# Altium project US29080671(A).PrjPCB (part 6 of 10)

## Sheet Z7_ETHERNET.SchDoc
size A2
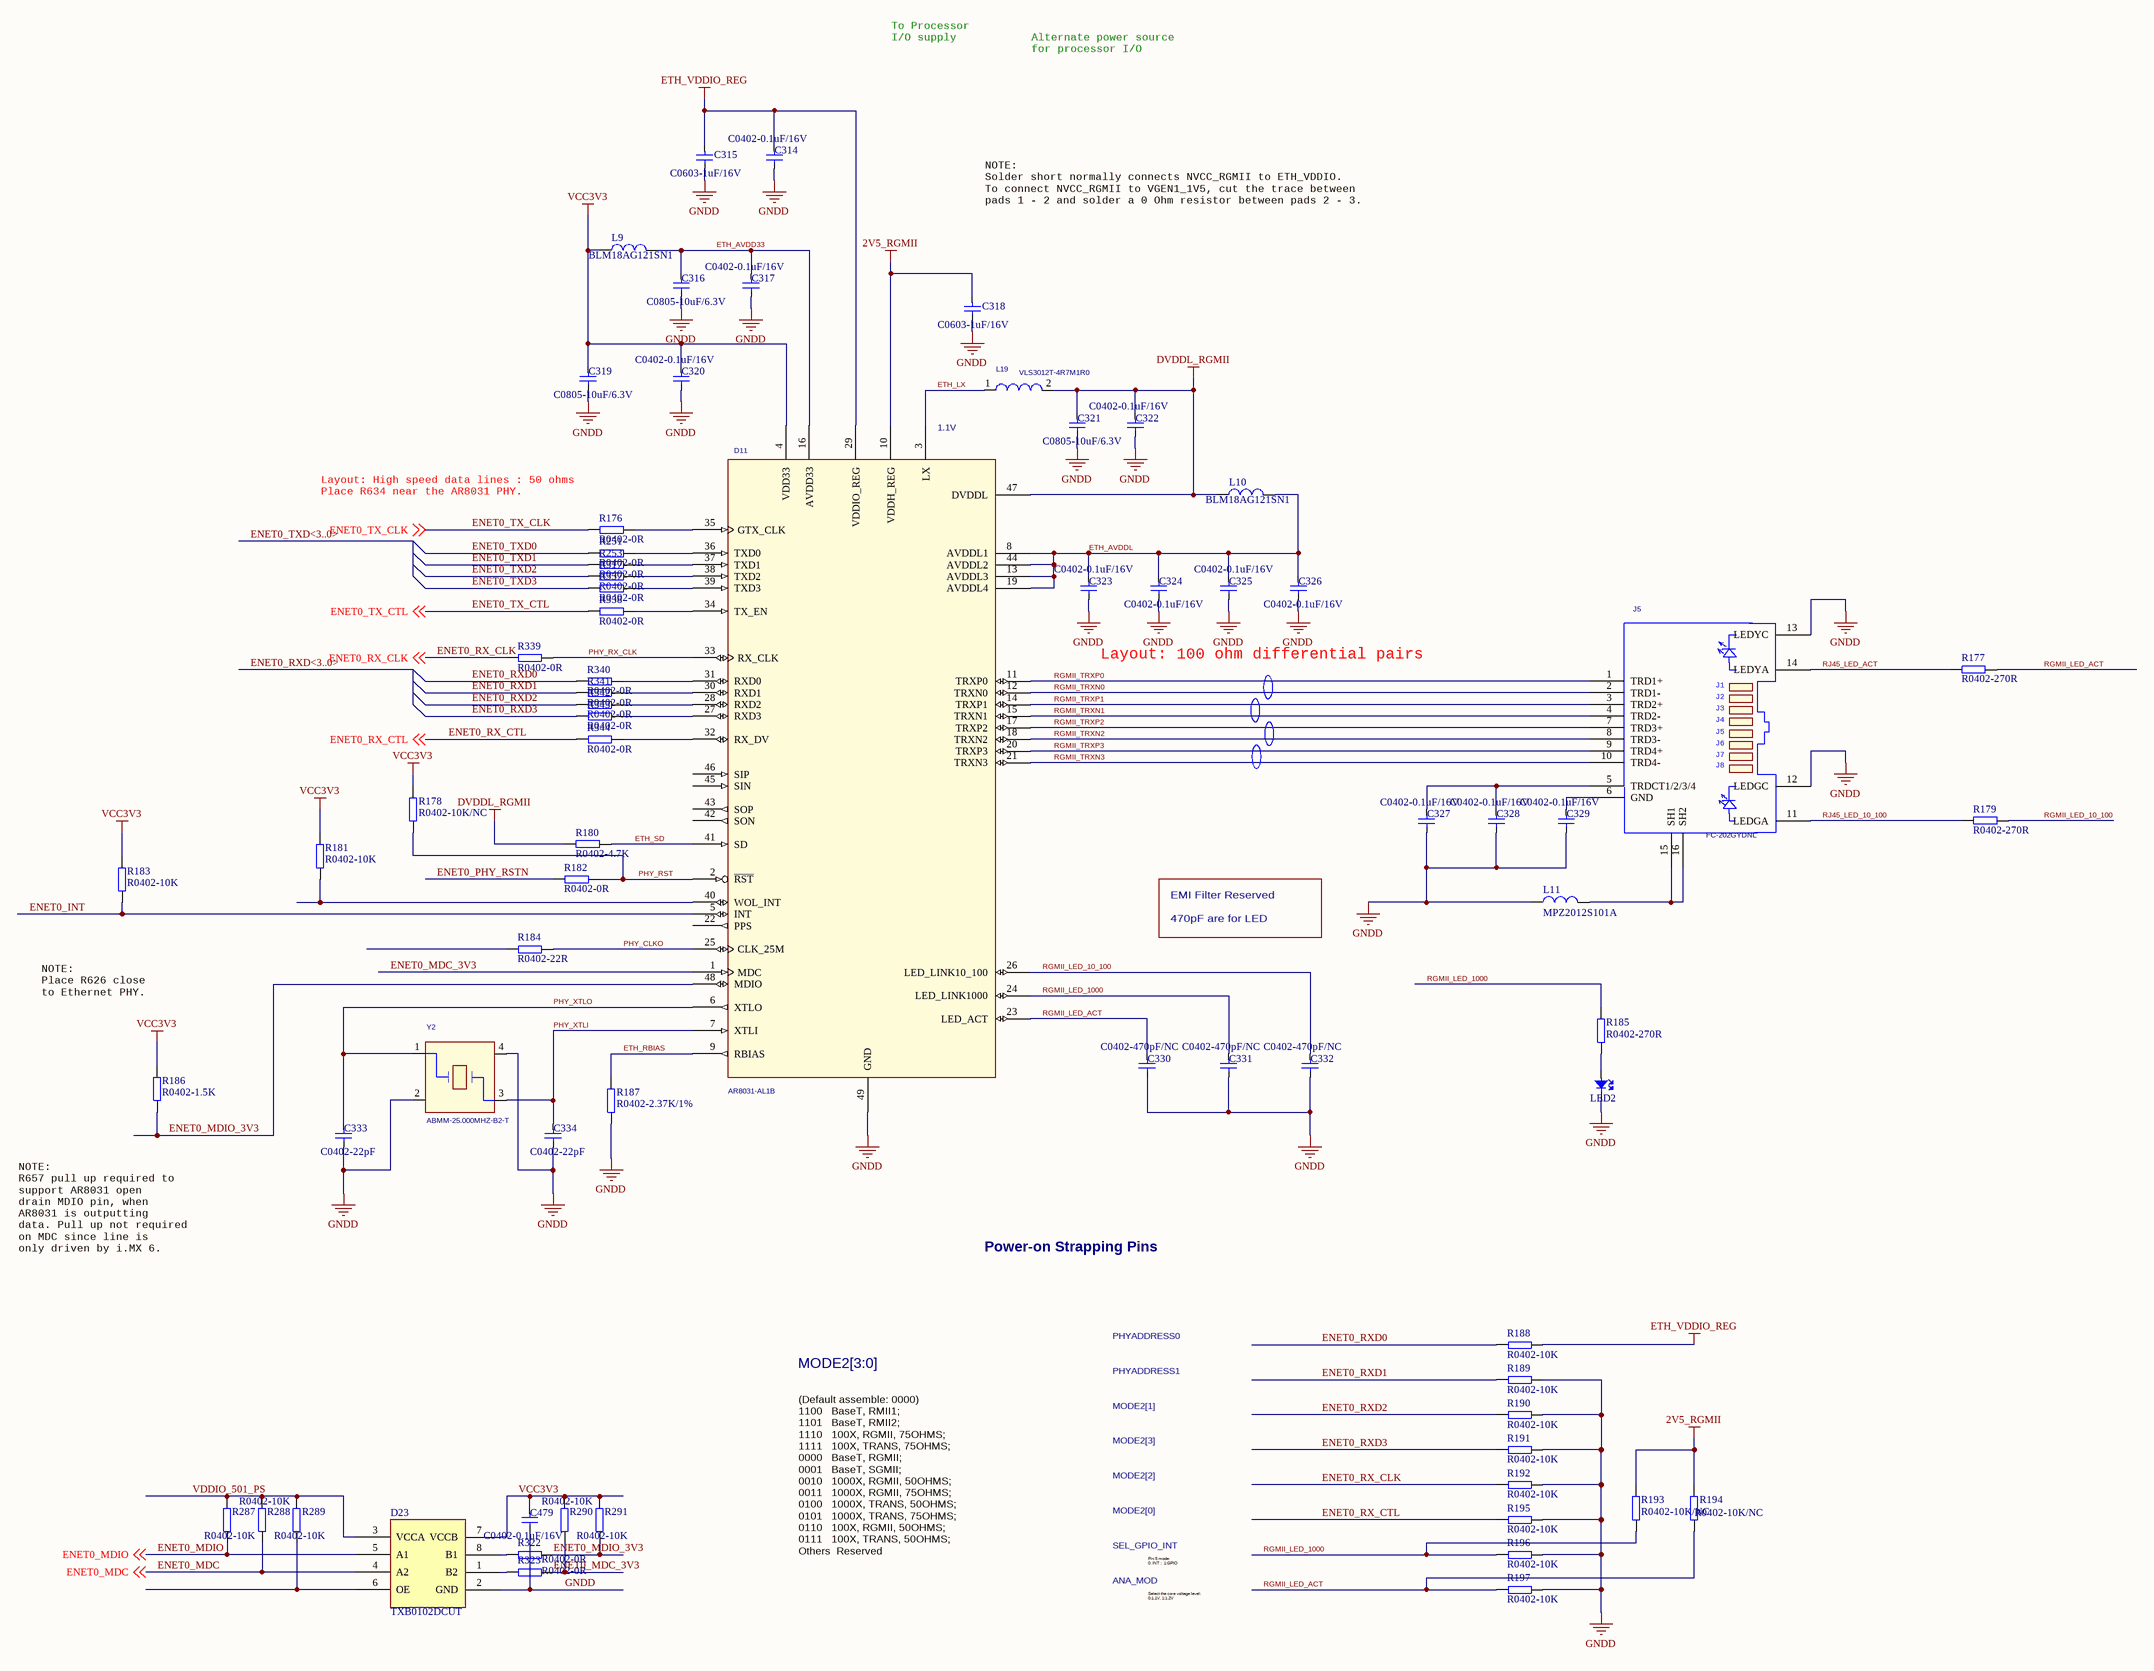
[diagram p30: Z7_ETHERNET.SchDoc]

### Parts
C314  C0402-0.1uF/16V  [C0402]
C315  C0603-1uF/16V  [C0603]
C316  C0805-10uF/6.3V  [C0805]
C317  C0402-0.1uF/16V  [C0402]
C318  C0603-1uF/16V  [C0603]
C319  C0805-10uF/6.3V  [C0805]
C320  C0402-0.1uF/16V  [C0402]
C321  C0805-10uF/6.3V  [C0805]
C322  C0402-0.1uF/16V  [C0402]
C323  C0402-0.1uF/16V  [C0402]
C324  C0402-0.1uF/16V  [C0402]
C325  C0402-0.1uF/16V  [C0402]
C326  C0402-0.1uF/16V  [C0402]
C327  C0402-0.1uF/16V  [C0402]
C328  C0402-0.1uF/16V  [C0402]
C329  C0402-0.1uF/16V  [C0402]
C330  C0402-470pF/NC  [C0402]
C331  C0402-470pF/NC  [C0402]
C332  C0402-470pF/NC  [C0402]
C333  C0402-22pF  [C0402]
C334  C0402-22pF  [C0402]
C479  C0402-0.1uF/16V  [C0402]
D11  AR8031-AL1B  [QFN-48N]
D23  TXB0102DCUT  [MSOP-8]
J5  FC-202GYDNL  [RJ45-1840710]
L9  BLM18AG121SN1  [R0603]
L10  BLM18AG121SN1  [R0603]
L11  MPZ2012S101A  [R0805]
L19  VLS3012T-4R7M1R0  [GTSD32P]
LED2  LED0603-GREEN  [LED-R0603]  (value not drawn)
R176  R0402-0R  [R0402]
R177  R0402-270R  [R0402]
R178  R0402-10K/NC  [R0402]
R179  R0402-270R  [R0402]
R180  R0402-4.7K  [R0402]
R181  R0402-10K  [R0402]
R182  R0402-0R  [R0402]
R183  R0402-10K  [R0402]
R184  R0402-22R  [R0402]
R185  R0402-270R  [R0402]
R186  R0402-1.5K  [R0402]
R187  R0402-2.37K/1%  [R0402]
R188  R0402-10K  [R0402]
R189  R0402-10K  [R0402]
R190  R0402-10K  [R0402]
R191  R0402-10K  [R0402]
R192  R0402-10K  [R0402]
R193  R0402-10K/NC  [R0402]
R194  R0402-10K/NC  [R0402]
R195  R0402-10K  [R0402]
R196  R0402-10K  [R0402]
R197  R0402-10K  [R0402]
R251  R0402-0R  [R0402]
R253  R0402-0R  [R0402]
R287  R0402-10K  [R0402]
R288  R0402-10K  [R0402]
R289  R0402-10K  [R0402]
R290  R0402-10K  [R0402]
R291  R0402-10K  [R0402]
R317  R0402-0R  [R0402]
R322  R0402-0R  [R0402]
R323  R0402-0R  [R0402]
R337  R0402-0R  [R0402]
R338  R0402-0R  [R0402]
R339  R0402-0R  [R0402]
R340  R0402-0R  [R0402]
R341  R0402-0R  [R0402]
R342  R0402-0R  [R0402]
R343  R0402-0R  [R0402]
R344  R0402-0R  [R0402]
Y2  ABMM-25.000MHZ-B2-T  [OSC3225-4P]

### Nets
2V5_RGMII: C318.1 D11.10(VDDH_REG) R193.2 R194.2
DVDDL_RGMII: C321.1 C322.1 D11.47(DVDDL) L10.1 L19.2 R180.2
ETH_VDDIO_REG: C314.1 C315.1 D11.29(VDDIO_REG) R188.2
GNDD: C314.2 C315.2 C316.2 C317.2 C318.2 C319.2 C320.2 C321.2 C322.2 C323.2 C324.2 C325.2 C326.2 C327.2 C328.2 C329.2 C330.2 C331.2 C332.2 C333.2 C334.2 C479.2 D11.49(GND) D23.2(GND) J5.12(LEDGC) J5.13(LEDYC) L11.1 LED2.2(K) R187.1 R189.2 R190.2 R191.2 R192.2 R195.2 R196.2 R197.2 Y2.2 Y2.4
VCC3V3: C319.1 C320.1 C479.1 D11.4(VDD33) D23.7(VCCB) L9.1 R178.2 R181.2 R183.2 R186.2 R290.2 R291.2
VDDIO_501_PS: D23.3(VCCA) R287.2 R288.2 R289.2  [project net VCC1V8]
ENET0_INT: D11.5(INT) R183.1
ENET0_MDC: D23.4(A2) R288.1 ; off-sheet ENET0_MDC
ENET0_MDC_3V3: D11.1(MDC) R290.1 R323.2
ENET0_MDIO: D23.5(A1) R287.1 ; off-sheet ENET0_MDIO
ENET0_MDIO_3V3: D11.48(MDIO) R186.1 R291.1 R322.2
ENET0_PHY_RSTN: R182.1
ENET0_RX_CLK: R192.1 R339.1 ; off-sheet ENET0_RX_CLK
ENET0_RX_CTL: R195.1 R344.1 ; off-sheet ENET0_RX_CTL
ENET0_RXD0: R188.1 R340.1
ENET0_RXD1: R189.1 R341.1
ENET0_RXD2: R190.1 R342.1
ENET0_RXD3: R191.1 R343.1
ENET0_TX_CLK: R176.1 ; off-sheet ENET0_TX_CLK
ENET0_TX_CTL: R338.1 ; off-sheet ENET0_TX_CTL
ENET0_TXD0: R251.1
ENET0_TXD1: R253.1
ENET0_TXD2: R317.1
ENET0_TXD3: R337.1
ETH_AVDD33: C316.1 C317.1 D11.16(AVDD33) L9.2
ETH_AVDDL: C323.1 C324.1 C325.1 C326.1 D11.8(AVDDL1) D11.13(AVDDL3) D11.19(AVDDL4) D11.44(AVDDL2) L10.2
ETH_LX: D11.3(LX) L19.1
ETH_RBIAS: D11.9(RBIAS) R187.2
ETH_SD: D11.41(SD) R180.1
PHY_CLKO: D11.25(CLK_25M) R184.2
PHY_RST: D11.2(~{RST}) R178.1 R182.2
PHY_RX_CLK: D11.33(RX_CLK) R339.2
PHY_XTLI: C334.1 D11.7(XTLI) Y2.3
PHY_XTLO: C333.1 D11.6(XTLO) Y2.1
RGMII_LED_10_100: C332.1 D11.26(LED_LINK10_100) R179.1
RGMII_LED_1000: C331.1 D11.24(LED_LINK1000) R185.2 R193.1 R196.1
RGMII_LED_ACT: C330.1 D11.23(LED_ACT) R177.1 R194.1 R197.1
RGMII_TRXN0: D11.12(TRXN0) J5.2(TRD1-)
RGMII_TRXN1: D11.15(TRXN1) J5.4(TRD2-)
RGMII_TRXN2: D11.18(TRXN2) J5.8(TRD3-)
RGMII_TRXN3: D11.21(TRXN3) J5.10(TRD4-)
RGMII_TRXP0: D11.11(TRXP0) J5.1(TRD1+)
RGMII_TRXP1: D11.14(TRXP1) J5.3(TRD2+)
RGMII_TRXP2: D11.17(TRXP2) J5.7(TRD3+)
RGMII_TRXP3: D11.20(TRXP3) J5.9(TRD4+)
RJ45_LED_10_100: J5.11(LEDGA) R179.2
RJ45_LED_ACT: J5.14(LEDYA) R177.2
NetC327_1: C327.1 C328.1 J5.5(TRDCT1/2/3/4)
NetC329_1: C329.1 J5.6(GND)
NetD11_27: D11.27(RXD3) R343.2
NetD11_28: D11.28(RXD2) R342.2
NetD11_30: D11.30(RXD1) R341.2
NetD11_31: D11.31(RXD0) R340.2
NetD11_32: D11.32(RX_DV) R344.2
NetD11_34: D11.34(TX_EN) R338.2
NetD11_35: D11.35(GTX_CLK) R176.2
NetD11_36: D11.36(TXD0) R251.2
NetD11_37: D11.37(TXD1) R253.2
NetD11_38: D11.38(TXD2) R317.2
NetD11_39: D11.39(TXD3) R337.2
NetD11_40: D11.40(WOL_INT) R181.1
NetD23_1: D23.1(B2) R323.1
NetD23_6: D23.6(OE) R289.1
NetD23_8: D23.8(B1) R322.1
NetJ5_15: J5.15(SH1) J5.16(SH2) L11.2
NetLED2_1: LED2.1(A) R185.1

Not connected (* = marked no-connect by the designer): D11 22(PPS) 42(SON) 43(SOP) 45(SIN) 46(SIP); R184 1

### Buses and harness runs
bus ENET0_RXD<3..0>
bus ENET0_TXD<3..0>

### Notes on the sheet
- To Processor
  I/O supply
- Alternate power source
  for processor I/O
- NOTE:
  Solder short normally connects NVCC_RGMII to ETH_VDDIO.
  To connect NVCC_RGMII to VGEN1_1V5, cut the trace between
  pads 1 - 2 and solder a 0 Ohm resistor between pads 2 - 3.
- (near D11) 1.1V
- Layout: High speed data lines : 50 ohms
  Place R634 near the AR8031 PHY.
- Layout: 100 ohm differential pairs
- 470pF are for LED
- EMI Filter Reserved
- NOTE:
  Place R626 close
  to Ethernet PHY.
- NOTE:
  R657 pull up required to
  support AR8031 open
  drain MDIO pin, when
  AR8031 is outputting
  data. Pull up not required
  on MDC since line is
  only driven by i.MX 6.
- Power-on Strapping Pins
- PHYADDRESS0
- MODE2[3:0]
- PHYADDRESS1
- MODE2[3]
- MODE2[1]
- MODE2[2]
- MODE2[0]
- SEL_GPIO_INT
- Pin 5 mode:
  0: INT ;  1:GPIO
- (Default assemble: 0000)
  1100   BaseT, RMII1;
  1101   BaseT, RMII2;
  1110   100X, RGMII, 75OHMS;
  1111   100X, TRANS, 75OHMS;
  0000   BaseT, RGMII;
  0001   BaseT, SGMII;
  0010   1000X, RGMII, 50OHMS;
  0011   1000X, RGMII, 75OHMS;
  0100   1000X, TRANS, 50OHMS;
  0101   1000X, TRANS, 75OHMS;
  0110   100X, RGMII, 50OHMS;
  0111   100X, TRANS, 50OHMS;
  Others  Reserved
- ANA_MOD
- Select the core voltage level:
  0:1.1V, 1:1.2V
- (in symbol V890-1AX1-A1_2) J1; J2; J3; J4; J6; J7; J8

### Library data of the parts
C314 C317 C320 C322-C334 C479 = C0402-0.1uF/16V: as C351-C357 on sheet Z7_POWER1; Part_type: CAP; temperature: -55℃\+125℃; Schematic_Part: CAP; PCB_Footprint: C0402; datasheet: #DataSheet\C_Samsung_General Capacitors.pdf#
  C314 C317 C320 C322-C329 C479: Part_number: C0402-0.1uF/16V; Value: C0402-0.1uF/16V
  C330-C332: Part_number: C0402-470pF/NC; Value: C0402-470pF/NC
  C333 C334: Part_number: C0402-22pF; Value: C0402-22pF
C315 C318 = C0603-100nF/16V: X7R; Part_number: C0603-1uF/16V; Part_type: CAP; Value: C0603-1uF/16V; temperature: -55℃\+125℃; Schematic_Part: CAP; PCB_Footprint: C0603
C316 C319 C321 = C1210-22uF/16V: Part_number: C0805-10uF/6.3V; Part_type: CAP; Value: C0805-10uF/6.3V; Schematic_Part: CAP; PCB_Footprint: C0805
D11 = AR8031_QFN48: IC XCVR ETHERNET PHY 10/100/1000G-BIT 3.3V QFN48; AGILE_PN: 312-80115; MFG_NAME01: Atheros Communications, Inc; CAD_APPROVED: Yes; CLASS: IC; MFG_PN01: AR8031-AL1B; ROHS: Yes; HEIGHT: 0.8MM
D23 = TXB0102: Part_number: TXB0102DCUT
J5 = V890-1AX1-A1_2: CON 10 RJ-45 SHLD TH G/Y LEDS 50MIL SP 662H AU 125L; CLASS: IO; CAD_APPROVED: Yes; MFG_NAME01: BEL FUSE; AGILE_PN: 210-79982; HEIGHT: 16.814MM; ROHS: Yes; MFG_PN01: FC-202GYDNL
L9 L10 = FB0805-330R@100MHz: Manufacturer: 村田; Part_number: BLM18AG121SN1; Part_type: BEAD; temperature: -55℃\+125℃; Value1: 330R@100MHz; Schematic_Part: BEAD; PCB_Footprint: R0603; Manufacturer_p/n: BLM18AG121SN1
L11 = FB0805-330R@100MHz: Manufacturer: TDK; Part_number: MPZ2012S101A; Part_type: BEAD; temperature: -55℃\+125℃; Value1: 330R@100MHz; Schematic_Part: BEAD; PCB_Footprint: R0805; Manufacturer_p/n: MPZ2012S101A
L19 = INDUCTOR_0: IND PWR 4.7UH@1MHZ 1A 20% SMD; PART_TYPE: INDUCTOR\POWER; CLASS: DISCRETE; ROOM: RGMII_PHY; AGILE_PN: 180-77706; MFG_NAME01: TDK; CAD_APPROVED: Yes; PRIORITY_PN: 024-00152; SIGNAL_MODEL: DEFAULT_INDUCTOR_4700nH_2_1; Tolerance: 20%; MFG_PN01: VLS3012T-4R7M1R0; ROHS: Yes; HEIGHT: 1.2MM
LED2 = LED-R_3: as LED3 on sheet Z7_JTAG&DEBUG; Part_number: LED0603-GREEN
R176-R197 R251 R253 R287-R291 R317 R322 R323 R337-R344 = R0402-10K: Manufacturer: SAMSUNG; Part_type: RES; Schematic_Part: RES; PCB_Footprint: R0402
  R176 R182 R251 R253 R317 R322 R323 R337-R344: Part_number: R0402-0R; Value: R0402-0R
  R177 R179 R185: Part_number: R0402-270R; Value: R0402-270R
  R178 R193 R194: Part_number: R0402-10K/NC; Value: R0402-10K/NC
  R180: Part_number: R0402-4.7K; Value: R0402-4.7K
  R181 R183 R188-R192 R195-R197 R287-R291: Part_number: R0402-10K; Value: R0402-10K
  R184: Part_number: R0402-22R; Value: R0402-22R
  R186: Part_number: R0402-1.5K; Value: R0402-1.5K
  R187: Part_number: R0402-2.37K/1%; Value: R0402-2.37K/1%
Y2 = XTAL_13Y: XTAL 25MHZ -- -- SMT; CLASS: IC; CAD_APPROVED: Yes; MFG_NAME01: ABRACON CORP; AGILE_PN: 230-77853; HEIGHT: 1.3MM; ROHS: Yes; MFG_PN01: ABMM-25.000MHZ-B2-T

## Sheet Z7_STORAGE.SchDoc
size A3
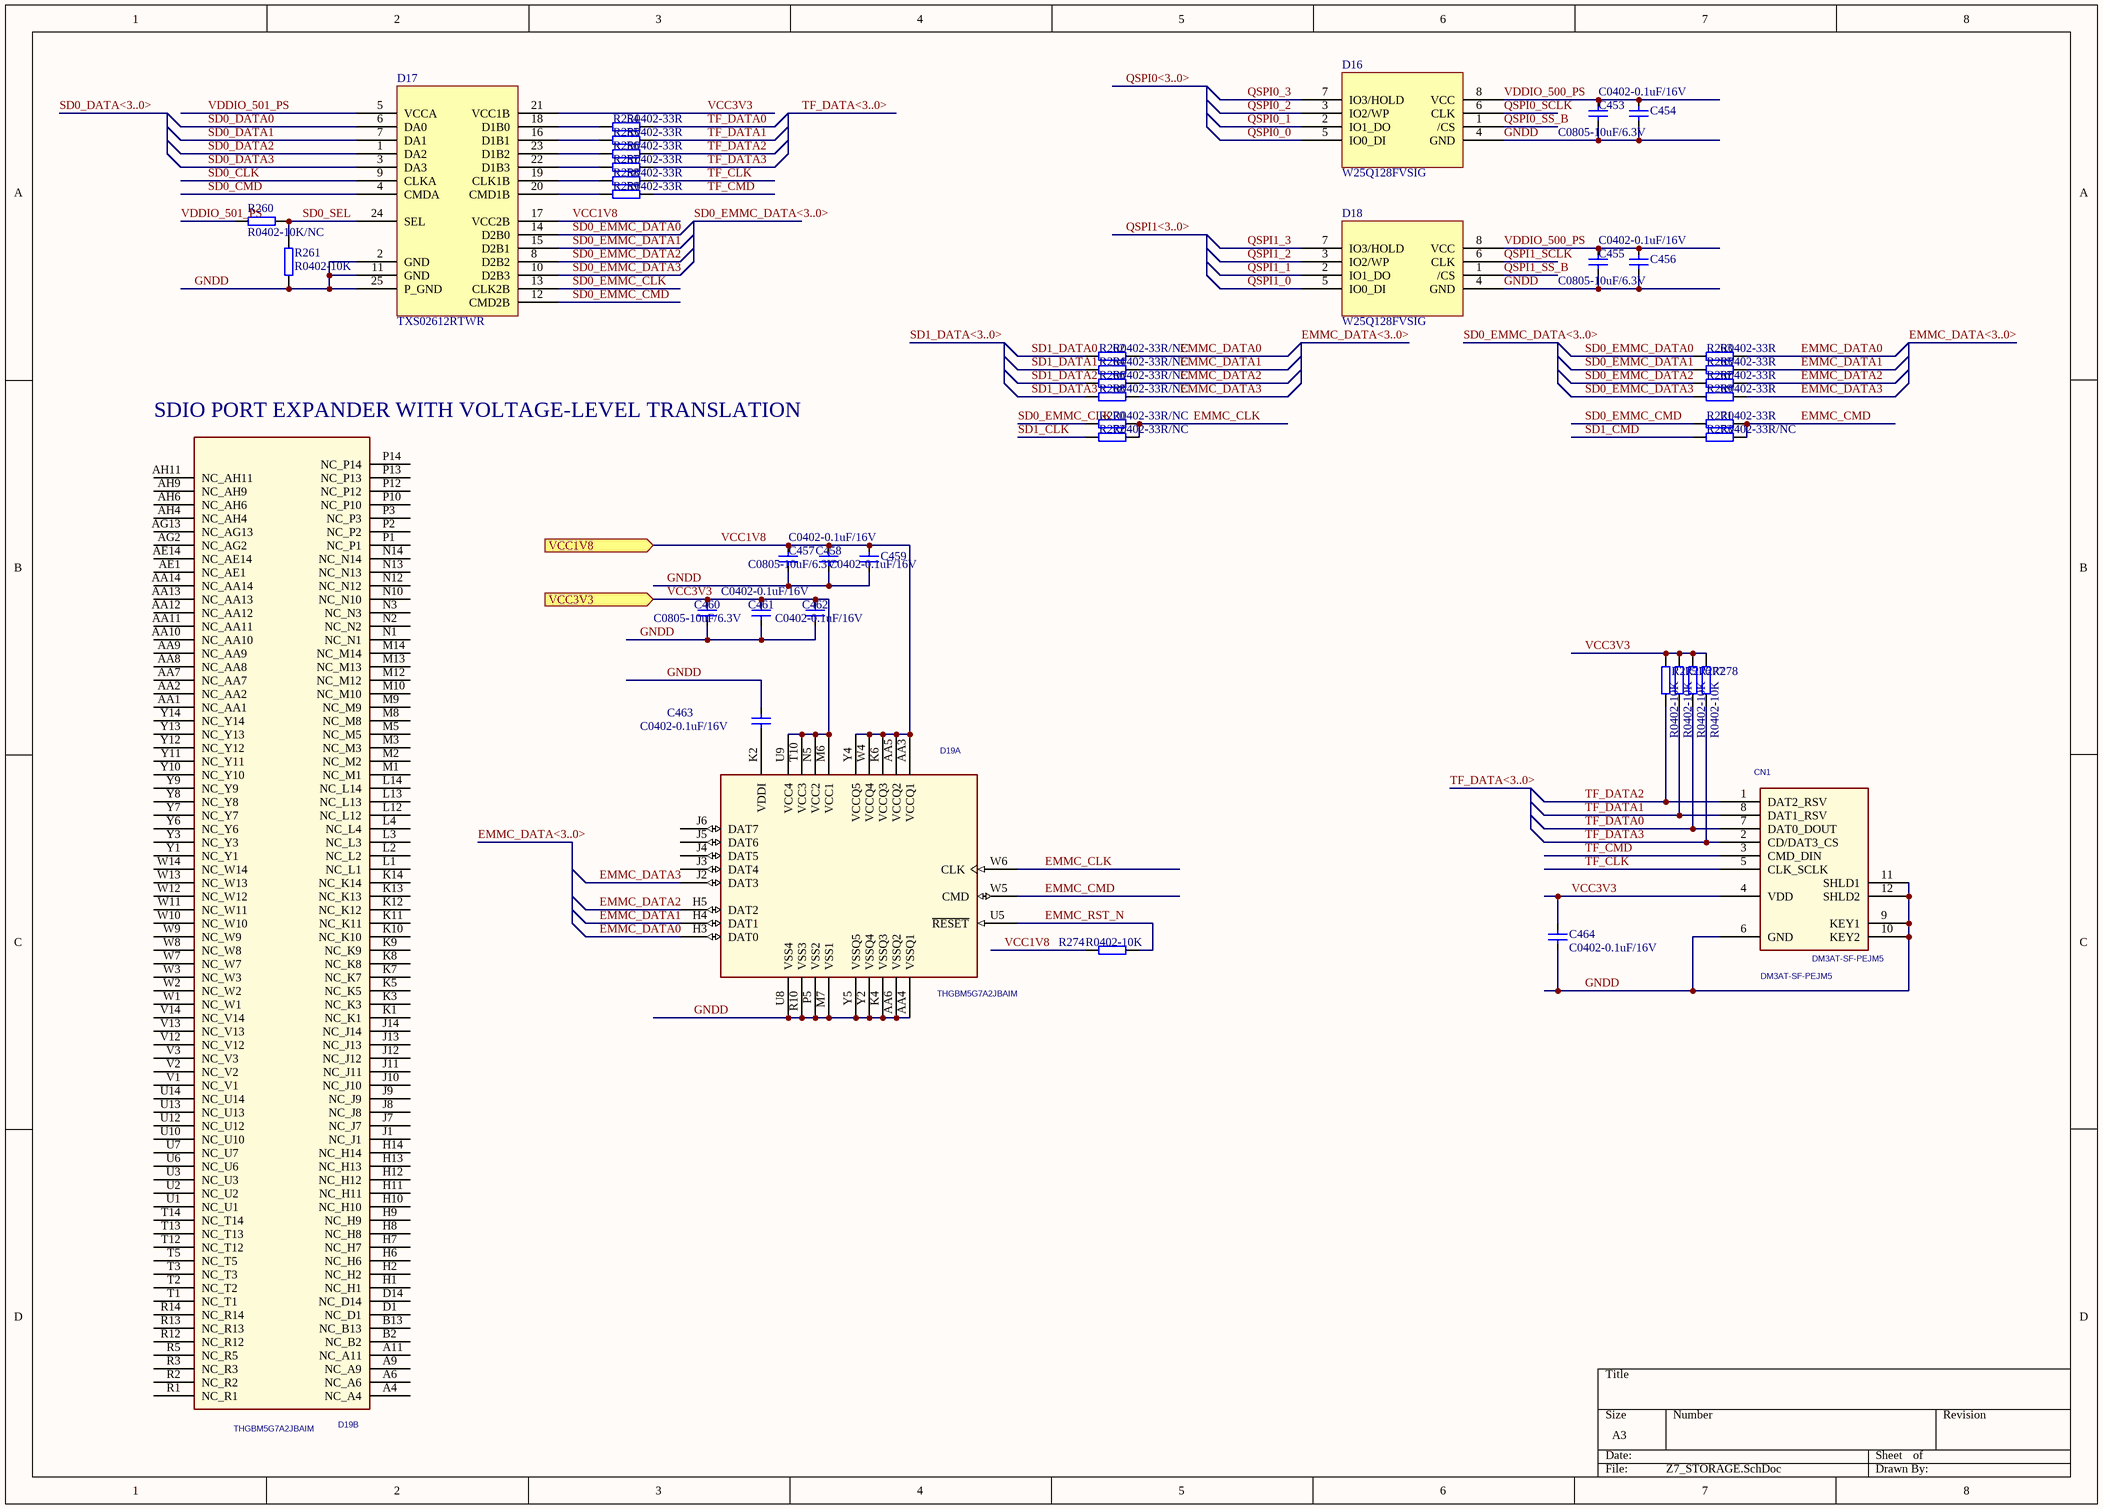
[diagram p31: Z7_STORAGE.SchDoc]

### Parts
C453  C0805-10uF/6.3V  [C0805]
C454  C0402-0.1uF/16V  [C0402]
C455  C0805-10uF/6.3V  [C0805]
C456  C0402-0.1uF/16V  [C0402]
C457  C0805-10uF/6.3V  [C0805]
C458  C0402-0.1uF/16V  [C0402]
C459  C0402-0.1uF/16V  [C0402]
C460  C0805-10uF/6.3V  [C0805]
C461  C0402-0.1uF/16V  [C0402]
C462  C0402-0.1uF/16V  [C0402]
C463  C0402-0.1uF/16V  [C0402]
C464  C0402-0.1uF/16V  [C0402]
CN1  DM3AT-SF-PEJM5  [HRS-SD]
D16  W25Q128FVSIG  [SOIC-W8]
D17  TXS02612RTWR  [QFN-24]
D18  W25Q128FVSIG  [SOIC-W8]
D19  THGBM5G7A2JBAIM  [BGA-169]  (parts A,B of 2)
R254  R0402-33R  [R0402]
R255  R0402-33R  [R0402]
R256  R0402-33R  [R0402]
R257  R0402-33R  [R0402]
R258  R0402-33R  [R0402]
R259  R0402-33R  [R0402]
R260  R0402-10K/NC  [R0402]
R261  R0402-10K  [R0402]
R262  R0402-33R/NC  [R0402]
R263  R0402-33R  [R0402]
R264  R0402-33R/NC  [R0402]
R265  R0402-33R  [R0402]
R266  R0402-33R/NC  [R0402]
R267  R0402-33R  [R0402]
R268  R0402-33R/NC  [R0402]
R269  R0402-33R  [R0402]
R270  R0402-33R/NC  [R0402]
R271  R0402-33R  [R0402]
R272  R0402-33R/NC  [R0402]
R273  R0402-33R/NC  [R0402]
R274  R0402-10K  [R0402]
R275  R0402-10K  [R0402]
R276  R0402-10K  [R0402]
R277  R0402-10K  [R0402]
R278  R0402-10K  [R0402]

### Ports
VCC1V8 (in), VCC3V3 (in)

### Nets
GNDD: C453.2 C454.1 C455.2 C456.1 C457.2 C458.1 C459.1 C460.2 C461.1 C462.1 C463.2 C464.1 CN1.6(GND) CN1.9(KEY1) CN1.10(KEY2) CN1.11(SHLD1) CN1.12(SHLD2) D16.4(GND) D17.2(GND) D17.11(GND) D17.25(P_GND) D18.4(GND) D19.AA4(VSSQ1) D19.AA6(VSSQ2) D19.K4(VSSQ3) D19.M7(VSS1) D19.P5(VSS2) D19.R10(VSS3) D19.U8(VSS4) D19.Y2(VSSQ4) D19.Y5(VSSQ5) R261.1
VCC1V8: C453.1 C454.2 C455.1 C456.2 C457.1 C458.2 C459.2 D16.8(VCC) D17.5(VCCA) D17.17(VCC2B) D18.8(VCC) D19.AA3(VCCQ1) D19.AA5(VCCQ2) D19.K6(VCCQ3) D19.W4(VCCQ4) D19.Y4(VCCQ5) R260.2 R274.1 ; port VCC1V8  [also labelled VDDIO_500_PS, VDDIO_501_PS]
VCC3V3: C460.1 C461.2 C462.2 C464.2 CN1.4(VDD) D17.21(VCC1B) D19.M6(VCC1) D19.N5(VCC2) D19.T10(VCC3) D19.U9(VCC4) R275.1 R276.1 R277.1 R278.1 ; port VCC3V3
EMMC_CLK: D19.W6(CLK) R270.2 R272.2
EMMC_CMD: D19.W5(CMD) R271.2 R273.2
EMMC_DATA0: D19.H3(DAT0) R262.2 R263.2
EMMC_DATA1: D19.H4(DAT1) R264.2 R265.2
EMMC_DATA2: D19.H5(DAT2) R266.2 R267.2
EMMC_DATA3: D19.J2(DAT3) R268.2 R269.2
EMMC_RST_N: D19.U5(~{RESET}) R274.2
QSPI0_0: D16.5(IO0_DI)
QSPI0_1: D16.2(IO1_DO)
QSPI0_2: D16.3(IO2/WP)
QSPI0_3: D16.7(IO3/HOLD)
QSPI0_SCLK: D16.6(CLK)
QSPI0_SS_B: D16.1(/CS)
QSPI1_0: D18.5(IO0_DI)
QSPI1_1: D18.2(IO1_DO)
QSPI1_2: D18.3(IO2/WP)
QSPI1_3: D18.7(IO3/HOLD)
QSPI1_SCLK: D18.6(CLK)
QSPI1_SS_B: D18.1(/CS)
SD0_CLK: D17.9(CLKA)
SD0_CMD: D17.4(CMDA)
SD0_DATA0: D17.6(DA0)
SD0_DATA1: D17.7(DA1)
SD0_DATA2: D17.1(DA2)
SD0_DATA3: D17.3(DA3)
SD0_EMMC_CLK: D17.13(CLK2B) R270.1
SD0_EMMC_CMD: D17.12(CMD2B) R271.1
SD0_EMMC_DATA0: D17.14(D2B0) R263.1
SD0_EMMC_DATA1: D17.15(D2B1) R265.1
SD0_EMMC_DATA2: D17.8(D2B2) R267.1
SD0_EMMC_DATA3: D17.10(D2B3) R269.1
SD0_SEL: D17.24(SEL) R260.1 R261.2
SD1_CLK: R272.1
SD1_CMD: R273.1
SD1_DATA0: R262.1
SD1_DATA1: R264.1
SD1_DATA2: R266.1
SD1_DATA3: R268.1
TF_CLK: CN1.5(CLK_SCLK) R258.2
TF_CMD: CN1.3(CMD_DIN) R259.2
TF_DATA0: CN1.7(DAT0_DOUT) R254.2 R277.2
TF_DATA1: CN1.8(DAT1_RSV) R255.2 R276.2
TF_DATA2: CN1.1(DAT2_RSV) R256.2 R275.2
TF_DATA3: CN1.2(CD/DAT3_CS) R257.2 R278.2
NetC463_1: C463.1 D19.K2(VDDI)
NetD17_16: D17.16(D1B1) R255.1
NetD17_18: D17.18(D1B0) R254.1
NetD17_19: D17.19(CLK1B) R258.1
NetD17_20: D17.20(CMD1B) R259.1
NetD17_22: D17.22(D1B3) R257.1
NetD17_23: D17.23(D1B2) R256.1

Not connected (* = marked no-connect by the designer): D19 A4(NC_A4) A6(NC_A6) A9(NC_A9) A11(NC_A11) AA1(NC_AA1) AA2(NC_AA2) AA7(NC_AA7) AA8(NC_AA8) AA9(NC_AA9) AA10(NC_AA10) AA11(NC_AA11) AA12(NC_AA12) AA13(NC_AA13) AA14(NC_AA14) AE1(NC_AE1) AE14(NC_AE14) AG2(NC_AG2) AG13(NC_AG13) AH4(NC_AH4) AH6(NC_AH6) AH9(NC_AH9) AH11(NC_AH11) B2(NC_B2) B13(NC_B13) D1(NC_D1) D14(NC_D14) H1(NC_H1) H2(NC_H2) H6(NC_H6) H7(NC_H7) H8(NC_H8) H9(NC_H9) H10(NC_H10) H11(NC_H11) H12(NC_H12) H13(NC_H13) H14(NC_H14) J1(NC_J1) J3(DAT4) J4(DAT5) J5(DAT6) J6(DAT7) J7(NC_J7) J8(NC_J8) J9(NC_J9) J10(NC_J10) J11(NC_J11) J12(NC_J12) J13(NC_J13) J14(NC_J14) K1(NC_K1) K3(NC_K3) K5(NC_K5) K7(NC_K7) K8(NC_K8) K9(NC_K9) K10(NC_K10) K11(NC_K11) K12(NC_K12) K13(NC_K13) K14(NC_K14) L1(NC_L1) L2(NC_L2) L3(NC_L3) L4(NC_L4) L12(NC_L12) L13(NC_L13) L14(NC_L14) M1(NC_M1) M2(NC_M2) M3(NC_M3) M5(NC_M5) M8(NC_M8) M9(NC_M9) M10(NC_M10) M12(NC_M12) M13(NC_M13) M14(NC_M14) N1(NC_N1) N2(NC_N2) N3(NC_N3) N10(NC_N10) N12(NC_N12) N13(NC_N13) N14(NC_N14) P1(NC_P1) P2(NC_P2) P3(NC_P3) P10(NC_P10) P12(NC_P12) P13(NC_P13) P14(NC_P14) R1(NC_R1) R2(NC_R2) R3(NC_R3) R5(NC_R5) R12(NC_R12) R13(NC_R13) R14(NC_R14) T1(NC_T1) T2(NC_T2) T3(NC_T3) T5(NC_T5) T12(NC_T12) T13(NC_T13) T14(NC_T14) U1(NC_U1) U2(NC_U2) U3(NC_U3) U6(NC_U6) U7(NC_U7) U10(NC_U10) U12(NC_U12) U13(NC_U13) U14(NC_U14) V1(NC_V1) V2(NC_V2) V3(NC_V3) V12(NC_V12) V13(NC_V13) V14(NC_V14) W1(NC_W1) W2(NC_W2) W3(NC_W3) W7(NC_W7) W8(NC_W8) W9(NC_W9) W10(NC_W10) W11(NC_W11) W12(NC_W12) W13(NC_W13) W14(NC_W14) Y1(NC_Y1) Y3(NC_Y3) Y6(NC_Y6) Y7(NC_Y7) Y8(NC_Y8) Y9(NC_Y9) Y10(NC_Y10) Y11(NC_Y11) Y12(NC_Y12) Y13(NC_Y13) Y14(NC_Y14)

### Buses and harness runs
bus EMMC_DATA<3..0>
bus QSPI0<3..0>
bus QSPI1<3..0>
bus SD0_DATA<3..0>
bus SD0_EMMC_DATA<3..0>
bus SD1_DATA<3..0>
bus TF_DATA<3..0>

### Notes on the sheet
- (near D19) SDIO PORT EXPANDER WITH VOLTAGE-LEVEL TRANSLATION

### Library data of the parts
C453 C455 C457 C460 = C1210-22uF/16V: Part_number: C0805-10uF/6.3V; Part_type: CAP; Value: C0805-10uF/6.3V; Schematic_Part: CAP; PCB_Footprint: C0805
C454 C456 C458 C459 C461-C464 = C0402-0.1uF/16V: as C351-C357 on sheet Z7_POWER1; Part_number: C0402-0.1uF/16V; Part_type: CAP; Value: C0402-0.1uF/16V; temperature: -55℃\+125℃; Schematic_Part: CAP; PCB_Footprint: C0402; datasheet: #DataSheet\C_Samsung_General Capacitors.pdf#
CN1 = HRS-SD: Part_number: DM3AT-SF-PEJM5
D17 = TXS02612: Part_number: TXS02612RTWR
D19 = SDIN5C2_TFBGA_169P: IC INAND MEM FLASH 8GB 2.7-3.6V TFBGA169; CAD_APPROVED: Yes; MFG_NAME01: SANDISK CORPORATION; AGILE_PN: 342-00495; CLASS: IC; HEIGHT: 1.2MM; ROHS: Yes; MFG_PN01: THGBM5G7A2JBAIM; partnumber: THGBM5G7A2JBAIM
R254-R278 = R0402-10K: Manufacturer: SAMSUNG; Part_type: RES; Schematic_Part: RES; PCB_Footprint: R0402
  R254-R259 R263 R265 R267 R269 R271: Part_number: R0402-33R; Value: R0402-33R
  R260: Part_number: R0402-10K/NC; Value: R0402-10K/NC
  R261 R274-R278: Part_number: R0402-10K; Value: R0402-10K
  R262 R264 R266 R268 R270 R272 R273: Part_number: R0402-33R/NC; Value: R0402-33R/NC
D16 D18 = W25Q128FVSIG: Part_number: W25Q128FVSIG